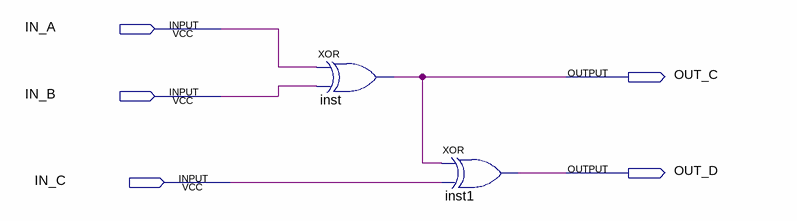
[diagram p0: schematic sheet]
// Quartus schematic compuerta_xor.bdf as structural Verilog: 2 symbols, 5 pins
module compuerta_xor (
  input  IN_A,
  input  IN_B,
  input  IN_C,
  output OUT_C,
  output OUT_D
);

  xor inst (OUT_C, IN_A, IN_B);
  xor inst1 (OUT_D, OUT_C, IN_C);
endmodule
